# Altium schematic sheet LVDS_RX.SchDoc
size A4; SheetNumber: 4; SheetTotal: 6
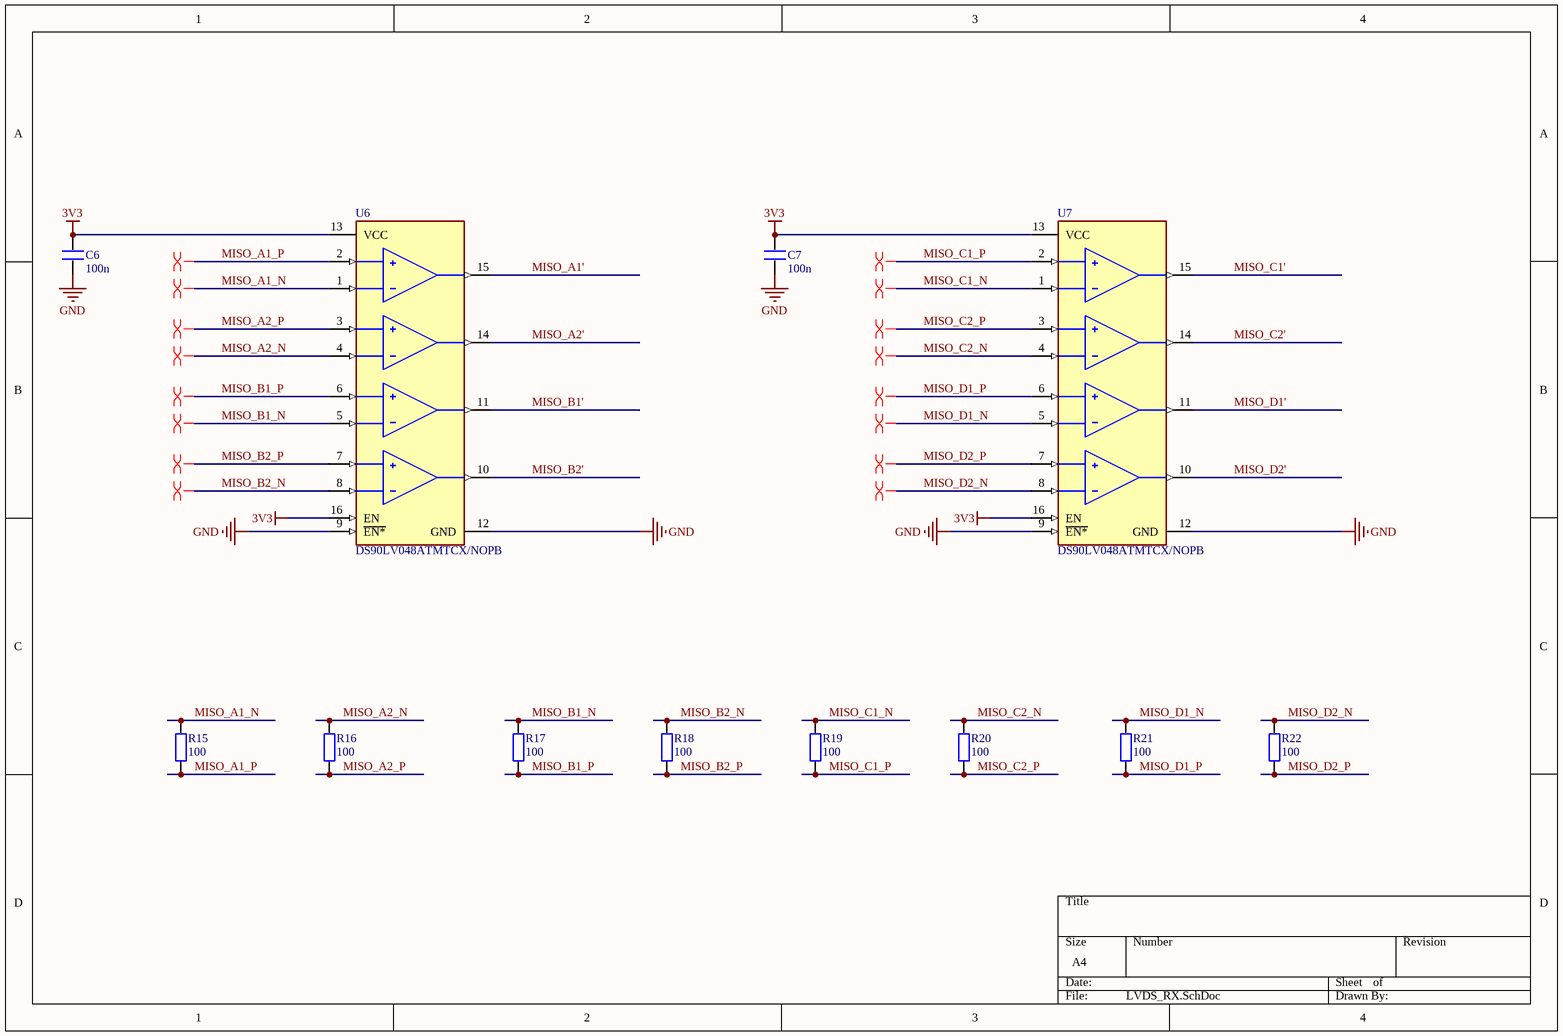
[diagram p0: LVDS_RX.SchDoc]

## Parts
C6  100n  [C 0402_L]
C7  100n  [C 0402_L]
R15  100  [R 0402_L]
R16  100  [R 0402_L]
R17  100  [R 0402_L]
R18  100  [R 0402_L]
R19  100  [R 0402_L]
R20  100  [R 0402_L]
R21  100  [R 0402_L]
R22  100  [R 0402_L]
U6  DS90LV048ATMTCX/NOPB  [FP-PW0016A-MFG]
U7  DS90LV048ATMTCX/NOPB  [FP-PW0016A-MFG]

## Nets
3V3: C6.2 C7.2 U6.13(VCC) U6.16(EN) U7.13(VCC) U7.16(EN)
GND: C6.1 C7.1 U6.9(~{EN*}) U6.12(GND) U7.9(~{EN*}) U7.12(GND)
MISO_A1': U6.15(ROUT1)
MISO_A1_N: R15.2 U6.1(RIN1-)
MISO_A1_P: R15.1 U6.2(RIN1+)
MISO_A2': U6.14(ROUT2)
MISO_A2_N: R16.2 U6.4(RIN2-)
MISO_A2_P: R16.1 U6.3(RIN2+)
MISO_B1': U6.11(ROUT3)
MISO_B1_N: R17.2 U6.5(RIN3-)
MISO_B1_P: R17.1 U6.6(RIN3+)
MISO_B2': U6.10(ROUT4)
MISO_B2_N: R18.2 U6.8(RIN4-)
MISO_B2_P: R18.1 U6.7(RIN4+)
MISO_C1': U7.15(ROUT1)
MISO_C1_N: R19.2 U7.1(RIN1-)
MISO_C1_P: R19.1 U7.2(RIN1+)
MISO_C2': U7.14(ROUT2)
MISO_C2_N: R20.2 U7.4(RIN2-)
MISO_C2_P: R20.1 U7.3(RIN2+)
MISO_D1': U7.11(ROUT3)
MISO_D1_N: R21.2 U7.5(RIN3-)
MISO_D1_P: R21.1 U7.6(RIN3+)
MISO_D2': U7.10(ROUT4)
MISO_D2_N: R22.2 U7.8(RIN4-)
MISO_D2_P: R22.1 U7.7(RIN4+)

## Layout directives
differential pair: MISO_A1_N, MISO_A1_P, MISO_A2_N, MISO_A2_P, MISO_B1_N, MISO_B1_P, MISO_B2_N, MISO_B2_P, MISO_C1_N, MISO_C1_P, MISO_C2_N, MISO_C2_P, MISO_D1_N, MISO_D1_P, MISO_D2_N, MISO_D2_P

## Library data of the parts
C6 C7 = C_1
R15-R22 = R_1: 贴片电阻; 版权归属: 源创客; BOM名称: 贴片电阻; 学习资源: www.ooocke.com
U6 U7 = CMP-04872-000109-1: IC RECEIVER 0/4 16TSSOP; Turn-On Delay Time: 2.7ns; Power Dissipation: 866mW; Number of Receivers: 4; Max Supply Voltage: 3.6V; Min Supply Voltage: 3V; Operating Supply Voltage: 3.3V; Operating Supply Current: 15mA; Min Input Voltage: -100mV; Max Supply Current: 9mA; Data Rate: 400Mbps; Power Consumption: 30W; Max Input Voltage: 0uV; Width: 4.4mm; REACH SVHC: No SVHC; Max Power Dissipation: 866mW; Case/Package: TSSOP; Length: 5mm; Packaging: Tape and Reel; Number of Elements: 4; Package Quantity: 2500; Weight: 0.002222oz; Number of Pins: 16; RoHS Compliant: Yes; Number of Channels: 4; Lead Free: Lead Free; Mount: Surface Mount; Number of Drivers: 4; Height: 0.9mm; Radiation Hardening: No; Logic Function: Receiver; Max Operating Temperature: 85°C; Min Operating Temperature: -40°C; Propagation Delay: 2.7ns